# EAGLE design vidclk13m5 (EAGLE 7.5.0)
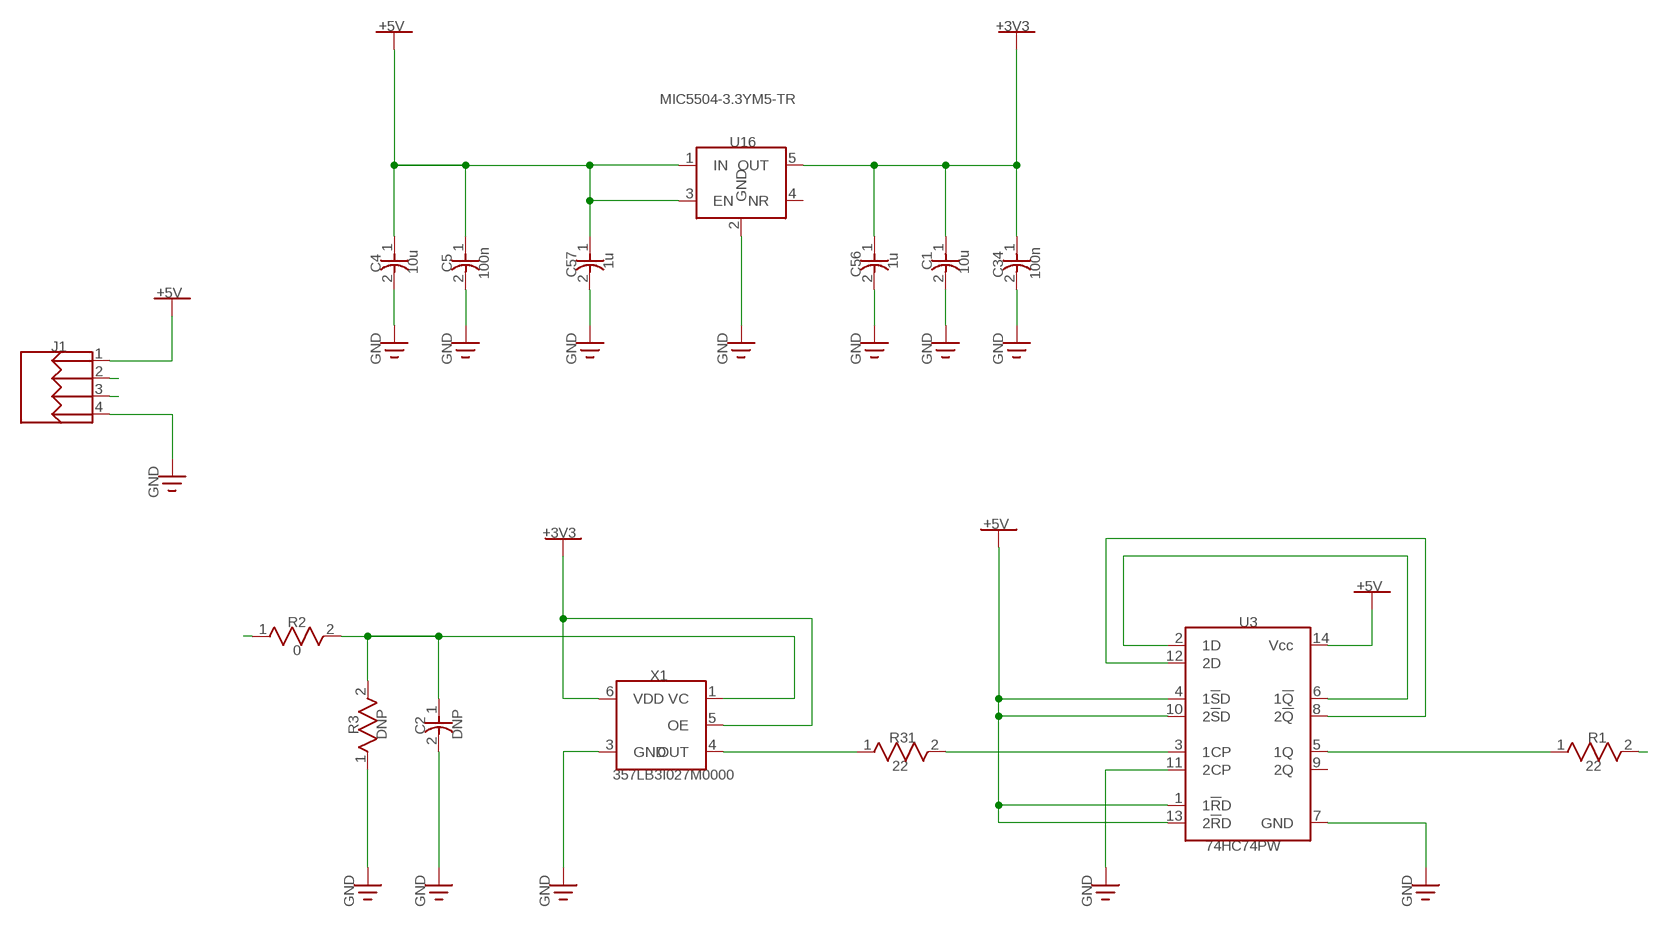
[diagram p0: schematic, sheet 1]

## Parts
C1  10u  CAP_0805  [CAP_0805]
C2  DNP  CAP_0603  [CAP_0603]
C4  10u  CAP_0805  [CAP_0805]
C5  100n  CAP_0603  [CAP_0603]
C34  100n  CAP_0603  [CAP_0603]
C56  1u  CAP_0603  [CAP_0603]
C57  1u  CAP_0603  [CAP_0603]
J1  644456-4  [HDR-1X4T/2.54/10X2]
R1  22  RES_0603_M  [RES_0603_M]
R2  0  RES_0603_M  [RES_0603_M]
R3  DNP  RES_0603_M  [RES_0603_M]
R31  22  RES_0603_M  [RES_0603_M]
U3  74HC74PW  [TSSOP-14]
U16  MIC5504-3.3YM5-TR  [SOT23-5]
X1  357LB3I027M0000  [CSX-750V]

## Nets
CLK: J1.3 R1.2
GND: C1.2 C2.2 C4.2 C5.2 C34.2 C56.2 C57.2 J1.4 R3.1 U3.7(GND) U3.11(2CP) U16.2(GND) X1.3(GND)
Net_1: U3.8(2!Q!) U3.12(2D)
Net_2: U3.2(1D) U3.6(1!Q!)
Net_3: C1.1 C34.1 C56.1 U16.5(OUT) X1.5(OE) X1.6(VDD) ; supply symbol labelled +3V3
Net_4: R1.1 U3.5(1Q)
Net_5: R31.1 X1.4(OUT)
Net_6: R31.2 U3.3(1CP)
Net_7: C2.1 R2.2 R3.2 X1.1(VC)
Net_8: C4.1 C5.1 C57.1 J1.1 U3.1(1!R!D) U3.4(1!S!D) U3.10(2!S!D) U3.13(2!R!D) U3.14(Vcc) U16.1(IN) U16.3(EN) ; supply symbol labelled +5V
VC: J1.2 R2.1
Unconnected: U3.9(2Q) U16.4(NR)

## Notes on the sheet
- +5V | +3V3
- MIC5504-3.3YM5-TR
- U16
- C4 | C5 | 1u | 1u | C1
- 10u | C57 | C56 | 10u | C34
- 100n | 100n
- +5V
- J1
- GND | GND | GND | GND | GND | GND | GND
- GND
- +5V
- +3V3
- +5V
- R2 | U3
- 0
- X1
- R3 | C2
- DNP | DNP | R31 | R1
- 22 | 22
- 357LB3I027M0000
- 74HC74PW
- GND | GND | GND | GND | GND

## Library data of the parts
C1 C4 = common:CAP_0805
C2 = common:CAP_0603
C5 C34 C56 C57 = common:CAP_0603; VALUE: DNP
J1 = common:644456-4; DATASHEET: http://datasheets.diptrace.com/con_headers/ENG_CD_644456_D2.pdf; MANUFACTURER: TE Connectivity
R1 R31 = common:RES_0603_M; UNIQUE_NAME: RES_0603_INCH
R2 R3 = common:RES_0603_M; UNIQUE_NAME: RES_0603_INCH; VALUE: 22
U3 = common:74HC74PW; DATASHEET: http://datasheets.diptrace.com/philips-nxp/74HC_HCT74.pdf; MANUFACTURER: NXP-Philips
U16 = common:MIC5504-3.3YM5-TR; MANUFACTURER: MICROCHIP
X1 = common:357LB3I027M0000; COST: 4.2625; MANUFACTURER: CTS Electronic Components; PREFERRED_VENDOR: DigiKey; PURCHASE_QUANTITY: 500; PURCHASE_QUANTITY_1: 500

## Board
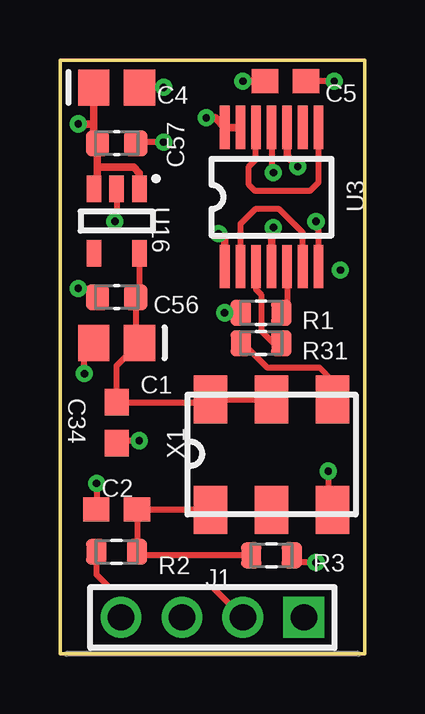
[diagram p1: board, top side]
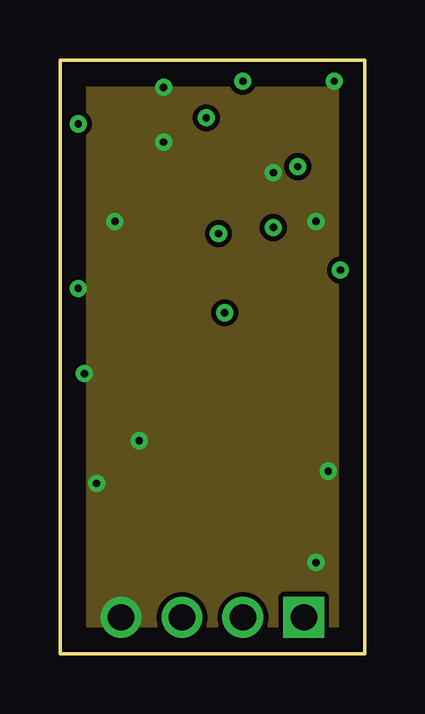
[diagram p2: board, inner layer Inner 1]
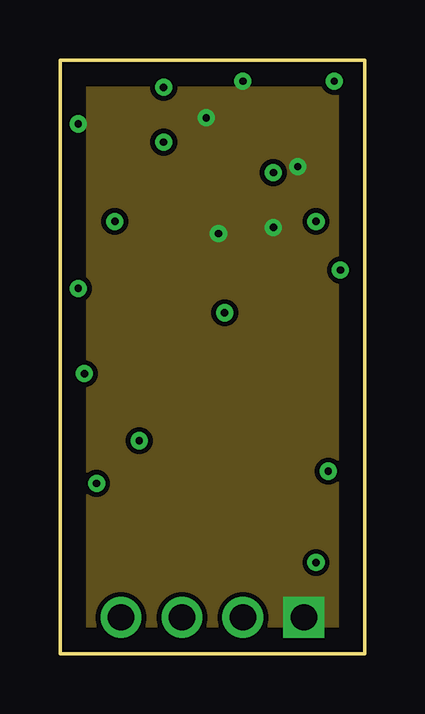
[diagram p3: board, inner layer Inner 2]
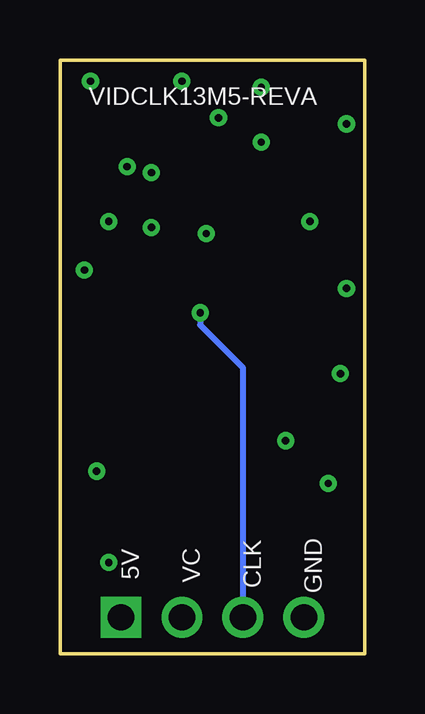
[diagram p4: board, bottom side, seen from below]

Size 12.7 x 24.77 mm. Coordinates in mm from the lower left corner, seen from the top.
Outline: 0,24.77 12.7,24.77 12.7,0 0,0 0,24.77
Copper layers (1+(2*15)+16): Top 0.035mm / dielectric 0.204mm / Inner 1 0.035mm / dielectric 1mm / Inner 2 0.035mm / dielectric 0.204mm / Bottom 0.035mm
Design rules "default *": minimum track width 10mil, minimum drill 0.61mm, track to track 8mil, track to pad 8mil, pad to pad 8mil, via to via 8mil, smd to smd 8mil, copper to edge 40mil, drill to drill 8mil, minimum pad ring 0mil, minimum via ring 8mil, stop-mask expansion 2mil, vias tented up to drill 12mil, thermal gap 10mil

### Footprints (pad centres in the part's own frame; a part is rotated, then mirrored left to right if it is on the bottom)
CAP_0805 = smd 1.3 x 1.5: 1 -0.95,0; 2 0.95,0
CAP_0603 = smd 1.1 x 1: 1 -0.85,0; 2 0.85,0
CAP_0805_C4 = smd 1.3 x 1.5: 1 -0.95,0; 2 0.95,0
CAP_0603_C5 = smd 1.1 x 1: 1 -0.85,0; 2 0.85,0
CAP_0603_C34 = smd 1.1 x 1: 1 -0.85,0; 2 0.85,0
CAP_0603_M = smd 0.97 x 1.07: 1 -0.8,0; 2 0.8,0
CAP_0603_M_C57 = smd 0.97 x 1.07: 1 -0.8,0; 2 0.8,0
HDR-1x4T/2.54/10x2 = drill 1.1 pad 1.7 square: 1 -3.81,0 | drill 1.1 pad 1.7: 2 -1.27,0; 3 1.27,0; 4 3.81,0
RES_0603_M = smd 0.85 x 1.07: 1 -0.845,0; 2 0.845,0
RES_0603_M_R2 = smd 0.85 x 1.07: 1 -0.845,0; 2 0.845,0
TSSOP-14 = smd 1.8 x 0.4: 1 -2.9,1.95; 2 -2.9,1.3; 3 -2.9,0.65; 4 -2.9,0; 5 -2.9,-0.65; 6 -2.9,-1.3; 7 -2.9,-1.95; 8 2.9,-1.95; 9 2.9,-1.3; 10 2.9,-0.65; 11 2.9,0; 12 2.9,0.65; 13 2.9,1.3; 14 2.9,1.95
SOT23-5 = smd 1.1 x 0.6: 1 -1.35,0.95; 2 -1.35,0; 3 -1.35,-0.95; 4 1.35,-0.95; 5 1.35,0.95
CSX-750V = smd 1.4 x 2: 1 -2.54,-2.3; 2 0,-2.3; 3 2.54,-2.3; 4 2.54,2.3; 5 0,2.3; 6 -2.54,2.3

### Placement (x,y rotation side)
C1  2.36,12.97 180 top
C2  2.36,6.03 180 top
C4  10u  [CAP_0805_C4]  2.36,23.62 0 top
C5  100n  [CAP_0603_C5]  9.4,23.88 0 top
C34  100n  [CAP_0603_C34]  2.36,9.64 270 top
C56  1u  [CAP_0603_M]  2.36,14.87 180 top
C57  1u  [CAP_0603_M_C57]  2.36,21.29 0 top
J1  644456-4  [HDR-1x4T/2.54/10x2]  6.35,1.52 180 top
R1  8.38,14.22 180 top
R2  0  [RES_0603_M_R2]  2.36,4.26 0 top
R3  8.81,4.11 180 top
R31  22  [RES_0603_M_R2]  8.38,12.95 0 top
U3  8.81,19.05 90 top
U16  2.36,18.05 270 top
X1  8.81,8.31 0 top

### Tracks (layer width: path | path; a pad name or v marks a point on that pad's centre or on a via)
CLK  (via drill 0.3 pad 0.61)
  Top 0.254: R1.2 v6.86,14.22
  Bottom 0.254: v6.86,14.22 6.86,13.72 5.08,11.94 J1.3
GND  (via drill 0.3 pad 0.61)
  Top 0.254: v4.32,23.62 C4.2 | v4.32,21.34 3.21,21.34 C57.2 | U16.2 2.36,18.11 v2.29,18.03 | v0.76,15.24 1.2,15.24 C56.2 | v1.02,11.68 1.02,12.57 C1.2 | v3.3,8.89 2.46,8.89 C34.2 | v1.52,7.11 1.52,6.04 C2.2 | v11.18,7.62 11.18,6.19 X1.3 | v10.67,3.81 9.96,3.81 R3.1 | v11.43,23.88 C5.2 | C5.2 | v10.67,18.03 10.67,17.78 10.76,17.68 U3.7 | U3.11 8.81,20.14 v8.89,20.07
  pour Inner 1 (isolate 0.127): 0.32,24.45 12.38,24.45 12.38,0.32 0.32,0.32
Net_1
  Top 0.254: U3.8 10.76,19.65 10.41,19.3 8.13,19.3 7.87,19.56 7.87,20.32 8.16,20.61 U3.12
Net_2
  Top 0.254: U3.6 10.11,17.57 9.14,18.54 8.13,18.54 7.51,17.93 U3.2
Net_3
  Top 0.254: X1.5 X1.6 6.15,10.49 C34.1 2.36,12.02 C1.1 3.16,13.12 C56.1 3.31,15.02 U16.5
Net_4
  Top 0.254: U3.5 9.46,14.46 R1.1
Net_5
  Top 0.254: R31.1 7.62,12.95 8.64,11.94 10.81,11.94 11.35,11.4 X1.4
Net_6
  Top 0.254: U3.3 8.16,15.2 8.38,14.99 8.38,13.46 8.89,12.95 R31.2
Net_7
  Top 0.254: R3.2 3.36,4.11 R2.2 C2.1 3.24,6.01 X1.1
Net_8  (via drill 0.3 pad 0.61)
  Top 0.305: C4.1 1.41,22.1 | 1.41,22.1 1.41,21.44 C57.1 1.56,20.3 | 1.56,20.3 1.56,19.55 U16.3 | v0.76,22.1 1.41,22.1 | U16.1 3.31,20.06 3.07,20.3 1.56,20.3 | v7.62,23.88 C5.1 | U3.10 9.46,20.76 v9.91,20.32 | v6.1,22.35 6.46,22.35 U3.14 U3.13 | U3.1 6.86,17.27 v6.6,17.53 | U3.4 8.81,17.7 v8.89,17.78
  pour Inner 2 (isolate 0.127): 0.32,24.45 12.38,24.45 12.38,0.32 0.32,0.32
S$1  (via drill 0.3 pad 0.61)
  other vias: 11.68,16
VC
  Top 0.254: R2.1 1.52,3.31 2.03,2.79 6.35,2.79 J1.2

### Text on the board
tPlace: C4 | C5 | C57 | U16 | U3 | C56 | R1 | R31 | C34 | C1 | X1 | C2 | R2 | J1 | R3
bPlace: VIDCLK13M5-REVA | GND | CLK | VC | 5V